# EAGLE schematic Planktoscope-Hat (EAGLE 9.6.2)
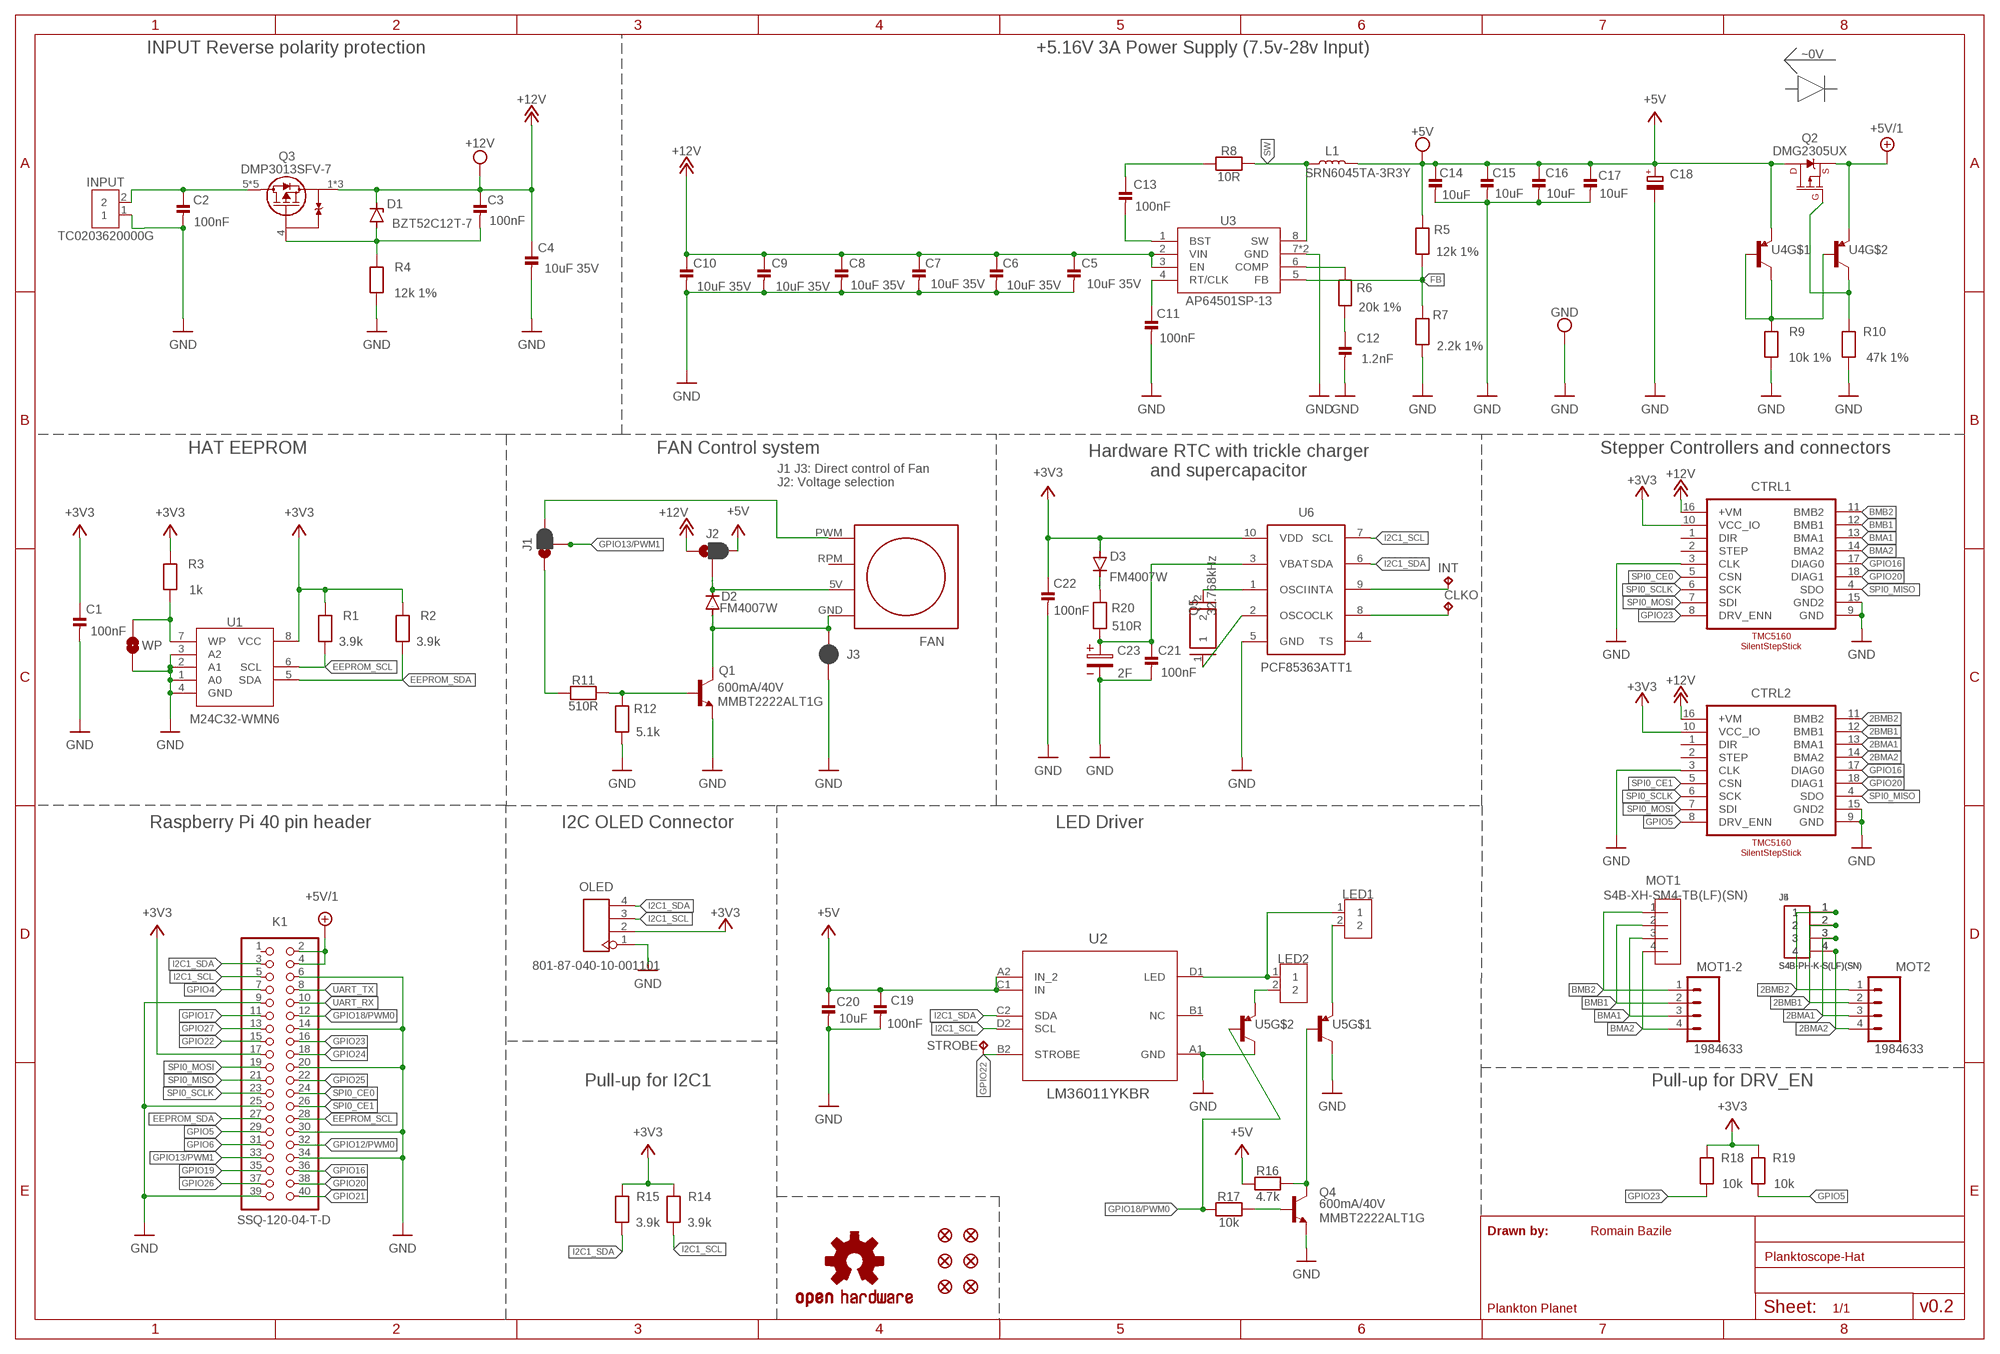
[diagram p0: schematic, sheet 1]

## Parts
+5V  TESTPOINTPAD2MM  [TESTPOINT_PAD_2MM]
+12V  TESTPOINTPAD2MM  [TESTPOINT_PAD_2MM]
C1  100nF  CAP_CERAMIC_0805MP  [_0805MP]
C2  100nF  CAP_CERAMIC_0805MP  [_0805MP]
C3  100nF  CAP_CERAMIC_0805MP  [_0805MP]
C4  10uF 35V  CAP_CERAMIC_0805MP  [_0805MP]
C5  10uF 35V  CAP_CERAMIC_0805MP  [_0805MP]
C6  10uF 35V  CAP_CERAMIC_0805MP  [_0805MP]
C7  10uF 35V  CAP_CERAMIC_0805MP  [_0805MP]
C8  10uF 35V  CAP_CERAMIC_0805MP  [_0805MP]
C9  10uF 35V  CAP_CERAMIC_0805MP  [_0805MP]
C10  10uF 35V  CAP_CERAMIC_0805MP  [_0805MP]
C11  100nF  CAP_CERAMIC_0805MP  [_0805MP]
C12  1.2nF  CAP_CERAMIC_0805MP  [_0805MP]
C13  100nF  CAP_CERAMIC_0805MP  [_0805MP]
C14  10uF  CAP_CERAMIC_0805MP  [_0805MP]
C15  10uF  CAP_CERAMIC_0805MP  [_0805MP]
C16  10uF  CAP_CERAMIC_0805MP  [_0805MP]
C17  10uF  CAP_CERAMIC_0805MP  [_0805MP]
C18  100µF 10VDC  C-POL_TANTALUM-2412(6032-METRIC)  [CAPMP6032X280N]
C19  100nF  CAP_CERAMIC_0805MP  [_0805MP]
C20  10uF  CAP_CERAMIC_0805MP  [_0805MP]
C21  100nF  CAP_CERAMIC_0805MP  [_0805MP]
C22  100nF  CAP_CERAMIC_0805MP  [_0805MP]
C23  2F  WCAP-PTHT_8X8_870135174001  [8X3.5X0.9(DXAXB)]
CLKO  TPB1,27  [B1,27]
CTRL1  TMC5160_SILENTSTEPSTICK  [TMC5160_STEPSTICK]
CTRL2  TMC5160_SILENTSTEPSTICK  [TMC5160_STEPSTICK]
D1  BZT52C12T-7  ZENER_SODFL(1608-METRIC)  [SODFL1608X70]
D2  FM4007W  DIODE-DO-214AC  [DO-214AC]
D3  FM4007W  DIODE-DO-214AC  [DO-214AC]
FAN  40MM_FAN  [40MM_FAN]
FD1  FIDUCIAL1X2  [FIDUCIAL-1X2]
FD2  FIDUCIAL1X2  [FIDUCIAL-1X2]
FD3  FIDUCIAL1X2  [FIDUCIAL-1X2]
FD4  FIDUCIAL1X2  [FIDUCIAL-1X2]
FD5  FIDUCIAL1X2  [FIDUCIAL-1X2]
FD6  FIDUCIAL1X2  [FIDUCIAL-1X2]
GND  TESTPOINTPAD2MM  [TESTPOINT_PAD_2MM]
INPUT  TC0203620000G  2828XX-2282837-2  [TERMBLK_508-2N]
INT  TPB1,27  [B1,27]
J1  JUMPER-SMT_3_1-NC_PASTE_SILK  [SMT-JUMPER_3_1-NC_PASTE_SILK]
J2  JUMPER-SMT_3_1-NC_PASTE_SILK  [SMT-JUMPER_3_1-NC_PASTE_SILK]
J3  JUMPER-SMT_2_NC_PASTE_SILK  [SMT-JUMPER_2_NC_PASTE_SILK]
J4  S4B-PH-K-S(LF)(SN)  [S4B-PH-K-S(LF)(SN)]
J5  S4B-PH-K-S(LF)(SN)  [S4B-PH-K-S(LF)(SN)]
K1  SSQ-120-04-T-D  PINHD-2X20  [2X20]
L1  SRN6045TA-3R3Y  INDUCTOR-SRN6045-33UH  [SRN6045]
LED1  2828XX-2282834-2  [TERMBLK_254-2N]
LED2  2828XX-2282834-2  [TERMBLK_254-2N]
LOGO1  OSHW-LOGOL  [OSHW-LOGO-L]
MOT1  S4B-XH-SM4-TB(LF)(SN)  [CONN_S4B-XH-SM4-TB_JST]
MOT1-2  1984633  CONN_04SCREW  [SCREWTERMINAL-3.5MM-4]
MOT2  1984633  CONN_04SCREW  [SCREWTERMINAL-3.5MM-4]
OLED  801-87-040-10-001101  DIP-BLACK-MALE-HEADER-VERT(4P-2.54)  [H4-2.54]
Q1  600mA/40V  TRANS_NPN-MMBT2222AL  [SOT23-3]
Q2  DMG2305UX  MOSFET_PCH-DMG2305UX-7  [SOT23-3]
Q3  DMP3013SFV-7  [POWERDI3333-8_UX_DIO]
Q4  600mA/40V  TRANS_NPN-MMBT2222AL  [SOT23-3]
Q5  32.768kHz  ABSO7  [XTAL_ABS07-32.768KHZ-T]
R1  3.9k  RESISTOR_0805MP  [_0805MP]
R2  3.9k  RESISTOR_0805MP  [_0805MP]
R3  1k  RESISTOR_0805MP  [_0805MP]
R4  12k 1%  RESISTOR_0805MP  [_0805MP]
R5  12k 1%  RESISTOR_0805MP  [_0805MP]
R6  20k 1%  RESISTOR_0805MP  [_0805MP]
R7  2.2k 1%  RESISTOR_0805MP  [_0805MP]
R8  10R  RESISTOR_0805MP  [_0805MP]
R9  10k 1%  RESISTOR_0805MP  [_0805MP]
R10  47k 1%  RESISTOR_0805MP  [_0805MP]
R11  510R  RESISTOR_0805MP  [_0805MP]
R12  5.1k  RESISTOR_0805MP  [_0805MP]
R14  3.9k  RESISTOR_0805MP  [_0805MP]
R15  3.9k  RESISTOR_0805MP  [_0805MP]
R16  4.7k  RESISTOR_0805MP  [_0805MP]
R17  10k  RESISTOR_0805MP  [_0805MP]
R18  10k  RESISTOR_0805MP  [_0805MP]
R19  10k  RESISTOR_0805MP  [_0805MP]
R20  510R  RESISTOR_0805MP  [_0805MP]
STROBE  TPTP15R  [TP15R]
U1  M24C32-WMN6  [SO-8_STM]
U2  LM36011YKBR  [YKB0008AGAG]
U3  AP64501SP-13  AP64500SP-13  [SO-8EP_DIO]
U4  TRANS_PNP_DUAL  [SOT363]
U5  TRANS_PNP_DUAL  [SOT363]
U6  PCF85363ATT1  [SOP50P590X90-10N]
WP  JUMPER-SMT_2_NO_SILK  [SMT-JUMPER_2_NO_SILK]

## Nets
2BMA1: CTRL2.13(BMA1) J4.3 J5.3 MOT2.3
2BMA2: CTRL2.14(BMA2) J4.4 J5.4 MOT2.4
2BMB1: CTRL2.12(BMB1) J4.2 J5.2 MOT2.2
2BMB2: CTRL2.11(BMB2) J4.1 J5.1 MOT2.1
+3V3: C1.1 C22.1 CTRL1.10(VCC_IO) CTRL2.10(VCC_IO) D3.A K1.17 OLED.2 R1.2 R2.2 R3.2 R14.2 R15.2 R18.2 R19.2 U1.8(VCC) U6.10(VDD)
+5V [supply]: +5V.P$1 C14.1 C15.1 C16.1 C17.1 C18.1(+) C19.1 C20.1 J2.3 L1.2 Q2.3(D) R5.2 R16.2 U2.A2(IN_2) U2.C1(IN) U4.1(E)
+5V/1 [supply]: K1.2 K1.4 Q2.2(S) U4.4(E)
+12V [supply]: +12V.P$1 C3.1 C4.1 C5.1 C6.1 C7.1 C8.1 C9.1 C10.1 CTRL1.16(+VM) CTRL2.16(+VM) D1.1(C) J2.1 Q3.1(S) Q3.2(S) Q3.3(S) U3.2(VIN) U3.3(EN)
/GPIO18: Q4.3(C) R16.1 U5.2(B)
/INT: INT.TP U6.9(INTA)
BMA1: CTRL1.13(BMA1) MOT1-2.3 MOT1.3
BMA2: CTRL1.14(BMA2) MOT1-2.4 MOT1.4
BMB1: CTRL1.12(BMB1) MOT1-2.2 MOT1.2
BMB2: CTRL1.11(BMB2) MOT1-2.1 MOT1.1
BST: C13.2 U3.1(BST)
CLKOUT: CLKO.TP U6.8(CLK)
COMP: R6.2 U3.6(COMP)
EEPROM_SCL: K1.28 R1.1 U1.6(SCL)
EEPROM_SDA: K1.27 R2.1 U1.5(SDA)
FB: R5.1 R7.2 U3.5(FB)
GND: C1.2 C2.2 C4.2 C5.2 C6.2 C7.2 C8.2 C9.2 C10.2 C11.2 C12.2 C14.2 C15.2 C16.2 C17.2 C18.2(-) C19.2 C20.2 C21.2 C22.2 C23.2 CTRL1.3(CLK) CTRL1.9(GND) CTRL1.15(GND2) CTRL2.3(CLK) CTRL2.9(GND) CTRL2.15(GND2) GND.P$1 INPUT.1 J3.1 K1.6 K1.9 K1.14 K1.20 K1.25 K1.30 K1.34 K1.39 OLED.1 Q1.2(E) Q4.2(E) R4.1 R7.1 R9.1 R10.1 R12.1 U1.1(A0) U1.2(A1) U1.3(A2) U1.4(GND) U2.A1(GND) U3.7(GND) U3.EPAD(GND) U5.3(C) U5.6(C) U6.5(GND) WP.1
GPIO4: K1.7
GPIO5: CTRL2.8(DRV_ENN) K1.29 R19.1
GPIO6: K1.31
GPIO12/PWM0: K1.32
GPIO13/PWM1: J1.2 K1.33
GPIO16: CTRL1.17(DIAG0) CTRL2.17(DIAG0) K1.36
GPIO17: K1.11
GPIO18/PWM0: K1.12 R17.1 U5.5(B)
GPIO19: K1.35
GPIO20: CTRL1.18(DIAG1) CTRL2.18(DIAG1) K1.38
GPIO21: K1.40
GPIO22: K1.15 STROBE.TP U2.B2(STROBE)
GPIO23: CTRL1.8(DRV_ENN) K1.16 R18.1
GPIO24: K1.18
GPIO25: K1.22
GPIO26: K1.37
GPIO27: K1.13
I2C1_SCL: K1.5 OLED.3 R14.1 U2.D2(SCL) U6.7(SCL)
I2C1_SDA: K1.3 OLED.4 R15.1 U2.C2(SDA) U6.6(SDA)
LED: LED1.1 LED2.1 U2.D1(LED)
LED1OUT: LED1.2 U5.1(E)
LED2OUT: LED2.2 U5.4(E)
N$3: R3.1 U1.7(WP) WP.2
N$5: Q5.2 U6.1(OSCI)
N$6: C3.2 D1.2(A) Q3.4(G) R4.2
N$7: Q5.1 U6.2(OSCO)
N$8: D2.A FAN.GND J3.2 Q1.3(C)
N$10: C13.1 R8.2
N$12: Q2.1(G) R10.2 U4.3(C)
N$14: C12.1 R6.1
N$15: R9.2 U4.2(B) U4.5(B) U4.6(C)
N$16: D2.C FAN.5V(+5V) J2.2
N$17: Q1.1(B) R11.2 R12.2
N$18: J1.1 R11.1
N$19: FAN.PWM J1.3
N$20: D3.C R20.2
N$25: Q4.1(B) R17.2
RT: C11.1 U3.4(RT/CLK)
SPI0_CE0: CTRL1.5(CSN) K1.24
SPI0_CE1: CTRL2.5(CSN) K1.26
SPI0_MISO: CTRL1.4(SDO) CTRL2.4(SDO) K1.21
SPI0_MOSI: CTRL1.7(SDI) CTRL2.7(SDI) K1.19
SPI0_SCLK: CTRL1.6(SCK) CTRL2.6(SCK) K1.23
SW: L1.1 R8.1 U3.8(SW)
UART_RX: K1.10
UART_TX: K1.8
VBACKUP: C21.1 C23.1 R20.1 U6.3(VBAT)
VIN [supply]: C2.1 INPUT.2 Q3.5(D) Q3.6(D) Q3.7(D) Q3.8(D) Q3.9(D)
Unconnected: CTRL1.1(DIR) CTRL1.2(STEP) CTRL2.1(DIR) CTRL2.2(STEP) FAN.RPM K1.1 U2.B1(NC) U6.4(TS)

## Notes on the sheet
- INPUT Reverse polarity protection | +5.16V 3A Power Supply (7.5v-28v Input)
- ~0V
- HAT EEPROM | FAN Control system | Stepper Controllers and connectors
- Hardware RTC with trickle charger
  and supercapacitor
- J1 J3: Direct control of Fan
  J2: Voltage selection
- Raspberry Pi 40 pin header | I2C OLED Connector | LED Driver
- Pull-up for I2C1 | Pull-up for DRV_EN
- Drawn by: | Romain Bazile
- Plankton Planet | v0.2

## Library data of the parts
+5V +12V GND = microbuilder:TESTPOINT: Test Point Various test points for characterisation and PCB testing TESTPOINT_SMT - Compact Surface Mount Test Point [Digikey: 5016KTR-ND]
C1-C17 C19-C22 = microbuilder:CAP_CERAMIC: Ceramic Capacitors For new designs, use the packages preceded by an '_' character since they are more reliable: The following footprints should be used on most boards: _0402 - Standard footprint for regular board layouts _0603 - Standard footprint for regular board layouts _0805 - Standard footprint for regular board layouts _1206 - Standard footprint for regular board layouts For extremely tight-pitch boards where space is at a premium, the following 'micro-pitch' footprints can be used (smaller pads, no silkscreen outline, etc.): _0402MP - Micro-pitch footprint for very dense/compact boards _0603MP - Micro-pitch footprint for very dense/compact boards _0805MP - Micro-pitch footprint for very dense/compact boards _1206MP - Micro-pitch footprint for very dense/compact boards
C18 = Capacitor:C-POL: Capacitor Polarised - Generic; CATEGORY: Capacitor; MPN: TPSC107K010T0200
C23 = Wurth_Elektronik_Passive_Capacitors_rev19a:WCAP-PTHT: WCAP-PTHT Aluminum Polymer Capacitors Characteristics Aluminum Polymer Capacitor Recommended soldering: Wave Operating temperature: -55°C to +125°C +125°C product series Low ESR at high frequency range Long life: 2000h @ +125°C Package name and Variant abbreviation: Package: D X A X B = Diameter of the outline X Pitch of the hole X Diameter of the hole. <http://katalog.we-online.de/media/images/eisos/WCAP-PTHT_pf2.jpg> Details see: http://katalog.we-online.de/en/pbs/WCAP-PTHT/ Created: 2015-02-06 2015 (C) Wurth Elektronik; MPN: SCCR12E105SRB; WE-NUMBER: 870135174001/390uF
CLKO INT STROBE = testpad:TP: Test pad
CTRL1 CTRL2 = PScope:TMC5160_SILENTSTEPSTICK
D1 = Diode:ZENER: Zener Diode - Generic; CATEGORY: Diode; SUB-CATEGORY: Zener; VALUE: ZENER
D2 D3 = diode:DIODE-: DIODE
FAN = PScope:40MM_FAN
FD1-FD6 = SparkFun-Aesthetics:FIDUCIAL: Fiducial Alignment Points Point-of-reference for pick-and-place machines and other optical instruments.
INPUT = Connector:2828XX-2: 2 Position Wire to Board Terminal Block Horizontal with Board Datasheet <https://www.te.com.cn/commerce/DocumentDelivery/DDEController?Action=showdoc&DocId=Catalog+Section%7F1308389_EUROSTYLE_TERMINAL_BLOCKS%7F0607%7Fpdf%7FEnglish%7FENG_CS_1308389_EUROSTYLE_TERMINAL_BLOCKS_0607.pdf%7F2-282837-5>; CATEGORY: Connector; DESCRIPTION: 2 Position Wire to Board Terminal Block Horizontal with Board 5.08 mm Through Hole; MANUFACTURER: TE Connectivity; MPN: TC0203620000G; OPERATING_TEMPERATURE: -40°C to +105°C; PART_STATUS: ACTIVE; ROHS_COMPLIANCE: RoHS Compliant; SERIES: 282837; SUBCATEGORY: Terminal Block; TYPE: Side Wire Entry
J1 J2 = SparkFun-Jumpers:JUMPER-SMT_3_1-NC_PASTE: Normally closed solder jumper (1 of 2 connections) This jumper has an aperture in the stencil to allow solder paste to bridge one of the two connections. One connection is normally closed (NC), while the other is normally open (NO). Wick off the solder to open the connection. Reapply solder to reclose the connection. Apply solder to the other side instead to change the current path.
J3 = SparkFun-Jumpers:JUMPER-SMT_2_NC_PASTE: Normally closed solder jumper This jumper has an aperture in the stencil to allow solder paste to bridge the split in the wire so it's normally closed (NC). Wick off the solder to open the connection. Reapply solder to reclose the connection.
J4 J5 = Headers:S4B-PH-K-S(LF)(SN): CONN HEADER R/A 4POS 2MM Manufacturer's datasheet <http://www.jst-mfg.com/product/pdf/eng/ePH.pdf>; CREATED_BY: PCBLayout.com; DIGIKEY_PARTNO: 455-1721-ND; MANUFACTURER: JST Sales America Inc.; MPN: S4B-PH-K-S(LF)(SN)
K1 = Connector:PINHD-2X20: PIN HEADER; CATEGORY: CONNECTOR; SUB-CATEGORY: PIN-HEADER
L1 = SparkFun-Coils:INDUCTOR: Inductors Resist changes in electrical current. Basically a coil of wire. SparkFun Products: SparkFun Load Cell Amplifier - HX711 <https://www.sparkfun.com/products/13879> IOIO-OTG - V2.2 <https://www.sparkfun.com/products/13613>; PROD_ID: NDUC-11627; VALUE: 33µH/±20%/1.4A
LED1 LED2 = Connector:2828XX-2: 2 Position Wire to Board Terminal Block Horizontal with Board Datasheet <https://www.te.com.cn/commerce/DocumentDelivery/DDEController?Action=showdoc&DocId=Catalog+Section%7F1308389_EUROSTYLE_TERMINAL_BLOCKS%7F0607%7Fpdf%7FEnglish%7FENG_CS_1308389_EUROSTYLE_TERMINAL_BLOCKS_0607.pdf%7F2-282837-5>
LOGO1 = SparkFun-Aesthetics:OSHW-LOGO: Open-Source Hardware (OSHW) Logo This logo indicates the piece of hardware it is found on incorporates a OSHW license and/or adheres to the definition of open source hardware found here: http://freedomdefined.org/OSHW
MOT1 = PScope:S4B-XH-SM4-TB(LF)(SN); BUILT_BY: EMA_Justin; COPYRIGHT: Copyright (C) 2018 Accelerated Designs. All rights reserved; DATASHEET: http://www.farnell.com/datasheets/1684882.pdf?_ga=2.23206330.1695985900.1582574926-861621671.1572890216&_gac=1.58313304.1582574926.CjwKCAiAhc7yBRAdEiwAplGxX0eXyKiGfj62eRMGG7KvwS8fdWH6vWjmriwTUSfyzPNlkVLVCkx_YhoCwGcQAvD_BwE; MANUFACTURER_PART_NUMBER: S4B-XH-SM4-TB(LF)(SN); MPN: S4B-XH-SM4-TB(LF)(SN); SOURCELIBRARY: JST_2020-02-24; VENDOR: JST
MOT1-2 MOT2 = SparkFun-Connectors:CONN_04: Multi connection point. Often used as Generic Header-pin footprint for 0.1 inch spaced/style header connections On any of the 0.1 inch spaced packages, you can populate with these: Break Away Headers - Straight <https://www.sparkfun.com/products/116> (PRT-00116) Break Away Male Headers - Right Angle <https://www.sparkfun.com/products/553> (PRT-00553) Female Headers <https://www.sparkfun.com/products/115> (PRT-00115) Break Away Headers - Machine Pin <https://www.sparkfun.com/products/117> (PRT-00117) Break Away Female Headers - Swiss Machine Pin <https://www.sparkfun.com/products/743> (PRT-00743) For SCREWTERMINALS and SPRING TERMINALS visit here: Screw Terimnals on SparkFun.com <https://www.sparkfun.com/search/results?term=Screw+Terminals> (5mm/3.5mm/2.54mm spacing) This device is also useful as a general connection point to wire up your design to another part of your project. Our various solder wires solder well into these plated through hole pads. Hook-Up Wire - Assortment (Stranded, 22 AWG) <https://www.sparkfun.com/products/11375> (PRT-11375) Hook-Up Wire - Assortment (Solid Core, 22 AWG) <https://www.sparkfun.com/products/11367> (PRT-11367) View the entire wire category on our website here <https://www.sparkfun.com/categories/141> Special notes: Molex polarized connector foot print use with SKU : PRT-08231 with associated crimp pins and housings. 1MM SMD Version SKU: PRT-10208; PROD_ID: 2xCONN-08399; SF_ID: 2xPRT-08084
OLED = OPL_Connector:DIP-BLACK-MALE-HEADER-VERT(4P-2.54): 320020017; MPN: P125-1104A0BS116A1; VALUE: 4p-2.54
Q1 Q4 = SparkFun-DiscreteSemi:TRANS_NPN: NPN transistor Current controlled devices typically used to amplify current or used as a switch. BC547 - COM-08928 <http://www.sparkfun.com/products/8928> (TO-92 45V 100mA) (1.Collector 2.Base 3.Emitter) 2N3904 - COM-00521 <http://www.sparkfun.com/products/521> (TO-92 40V 200mA) (1.Emitter 2.Base 3.Collector) P2N2222A - COM-12852 <http://www.sparkfun.com/products/12852> (TO-92 40V 600mA) (1.Collector 2.Base 3.Emitter); MPN: MMBT2222ALT1G; PROD_ID: TRANS-08049
Q2 = SparkFun-DiscreteSemi:MOSFET_PCH: P-channel MOSFETs Voltage controlled devices that allow control of high current outputs. SparkFun Products: SparkFun ESP32 Thing <https://www.sparkfun.com/products/13907> SparkFun ESP8266 Thing <https://www.sparkfun.com/products/13231> SparkFun Pi Servo HAT V2 <https://www.sparkfun.com/products/15316> DMG2305UX-7 (20V/4.2A/SOT23-3); PROD_ID: TRAN-14388; VALUE: 20V/4.2A/52mΩ/1.4W
Q3 = PScope:DMP3013SFV-7; ALT_MANUFACTURER: VISHAY; ALT_MANUFACTURE_PART_NUMBER: SI7101DN; BUILT_BY: EMA_Cory; COPYRIGHT: Copyright (C) 2018 Accelerated Designs. All rights reserved; DATASHEET: https://www.diodes.com/assets/Datasheets/DMP3013SFV.pdf; MANUFACTURER_PART_NUMBER: DMP3013SFV-7; SOURCELIBRARY: Diodes_Inc_2020-06-18; VENDOR: Diodes Inc
Q5 = Frequency-Source:ABSO7: CRYSTAL 32.7680KHZ 12.5PF SMD Datasheet <https://abracon.com/Resonators/ABS07.pdf>; CATEGORY: Crystal; MANUFACTURER: Abracon LLC; MPN: ABS07-32.768KHZ-T; OPERATING_TEMPERATURE: -40°C ~ 85°C; PART_STATUS: ACTIVE; ROHS_COMPLIANT: COMPLIANT; SERIES: ABS07; SUB_CATEGORY: Crystal Surface Mount; TYPE: Crystal
R1-R12 R14-R20 = microbuilder:RESISTOR: Resistors For new designs, use the packages preceded by an '_' character since they are more reliable: The following footprints should be used on most boards: _0402 - Standard footprint for regular board layouts _0603 - Standard footprint for regular board layouts _0805 - Standard footprint for regular board layouts _1206 - Standard footprint for regular board layouts For extremely tight-pitch boards where space is at a premium, the following 'micro-pitch' footprints can be used (smaller pads, no silkscreen outline, etc.): _0402MP - Micro-pitch footprint for very dense/compact boards _0603MP - Micro-pitch footprint for very dense/compact boards _0805MP - Micro-pitch footprint for very dense/compact boards _1206MP - Micro-pitch footprint for very dense/compact boards
U1 = PScope:M24C32-WMN6; BUILT_BY: EMA_UL_Team; MANUFACTURER_PART_NUMBER: M24C32-WMN6; SOURCELIBRARY: StMicro_2011-06-07; VENDOR: STMicroelectronics
U2 = PScope:LM36011YKBR; MANUFACTURER: Texas Instruments; PARTNUMBER: LM36011YKBR; REFDES: RefDes; TYPE: TYPE; VALUE: Value
U3 = PScope:AP64500SP-13; BUILT_BY: EMA_Cory; COPYRIGHT: Copyright (C) 2018 Accelerated Designs. All rights reserved; DATASHEET: https://www.diodes.com/assets/Datasheets/AP64500.pdf; MANUFACTURER_PART_NUMBER: AP64500SP-13; SOURCELIBRARY: Diodes_Inc_2020-08-19; VENDOR: Diodes Inc
U4 U5 = PScope:TRANS_PNP_DUAL: Dual PNP Transistors in Single Package The BCM857BS puts two PNP transistors in a single package. Bipolar (BJT) Transistor Array 2 PNP (Dual) 45V 100mA 100MHz 200mW Surface Mount SOT-363 Datasheet <https://www.diodes.com/assets/Datasheets/BCM857BS.pdf> SparkFun Products: SparkFun Pi Servo HAT V2 <https://www.sparkfun.com>
U6 = PScope:PCF85363A
WP = SparkFun-Jumpers:JUMPER-SMT_2_NO: Normally open jumper This jumper has two pads in close proximity to each other. Apply solder to close the connection. Round pads are easier to solder for beginners, but are a lot larger. SparkFun Product that uses the round pads: SparkFun EL Sequencer <https://www.sparkfun.com/products/12781>

## Net classes
1 supply: clearance 0.4 mm to class 0